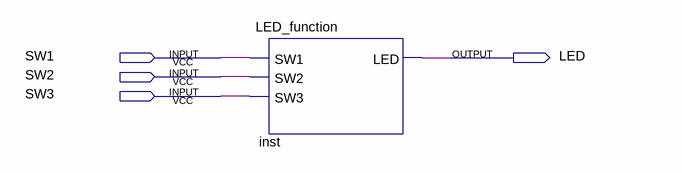
[diagram p0: schematic sheet]
// Quartus schematic LED_function_block.bdf as structural Verilog: 1 symbols, 4 pins
module LED_function_block (
  input  SW1,
  input  SW2,
  input  SW3,
  output LED
);

  LED_function inst (.SW1(SW1), .SW2(SW2), .SW3(SW3), .LED(LED));
endmodule
